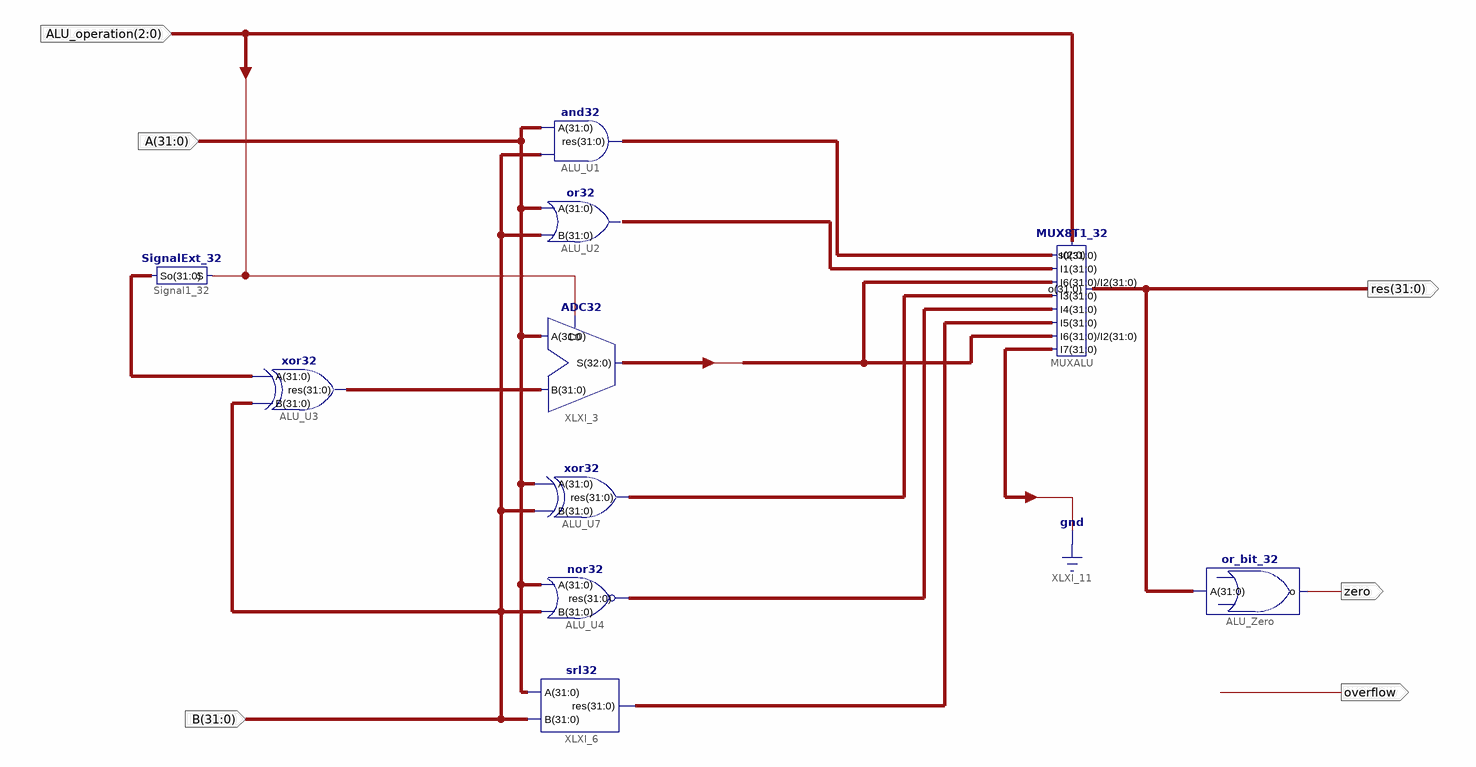
[diagram p0: schematic sheet 1]
// Xilinx ISE schematic alu.sch (kintex7) as structural Verilog: 10 symbols, 6 ports
module alu (
  input  [31:0] A,
  input  [31:0] B,
  input  [2:0] ALU_operation,
  output [31:0] res,
  output zero,
  output overflow
);

  wire [31:0] XLXN_1, XLXN_12, XLXN_18, XLXN_19, XLXN_22, XLXN_24, XLXN_27;
  wire [32:0] S;

  and32 ALU_U1 (.res(XLXN_18), .A(A), .B(B));
  or32 ALU_U2 (.res(XLXN_19), .A(A), .B(B));
  ADC32 XLXI_3 (.B(XLXN_1), .A(A), .C0(ALU_operation[2]), .S(S));
  xor32 ALU_U7 (.A(A), .B(B), .res(XLXN_22));
  nor32 ALU_U4 (.res(XLXN_24), .A(A), .B(B));
  srl32 XLXI_6 (.A(A), .B(B), .res(XLXN_27));
  xor32 ALU_U3 (.A(XLXN_12), .B(B), .res(XLXN_1));
  or_bit_32 ALU_Zero (.o(zero), .A(res));
  MUX8T1_32 MUXALU (
    .s(ALU_operation), .I7({{31{1'b0}}, S[32]}), .I6(S[31:0]), .I5(XLXN_27), .I4(XLXN_24), .I3(XLXN_22),
    .I2(S[31:0]), .I1(XLXN_19), .I0(XLXN_18), .o(res));
  SignalExt_32 Signal1_32 (.So(XLXN_12), .S(ALU_operation[2]));
endmodule
